# Altium schematic sheet FMB_MOS.SchDoc
size A3
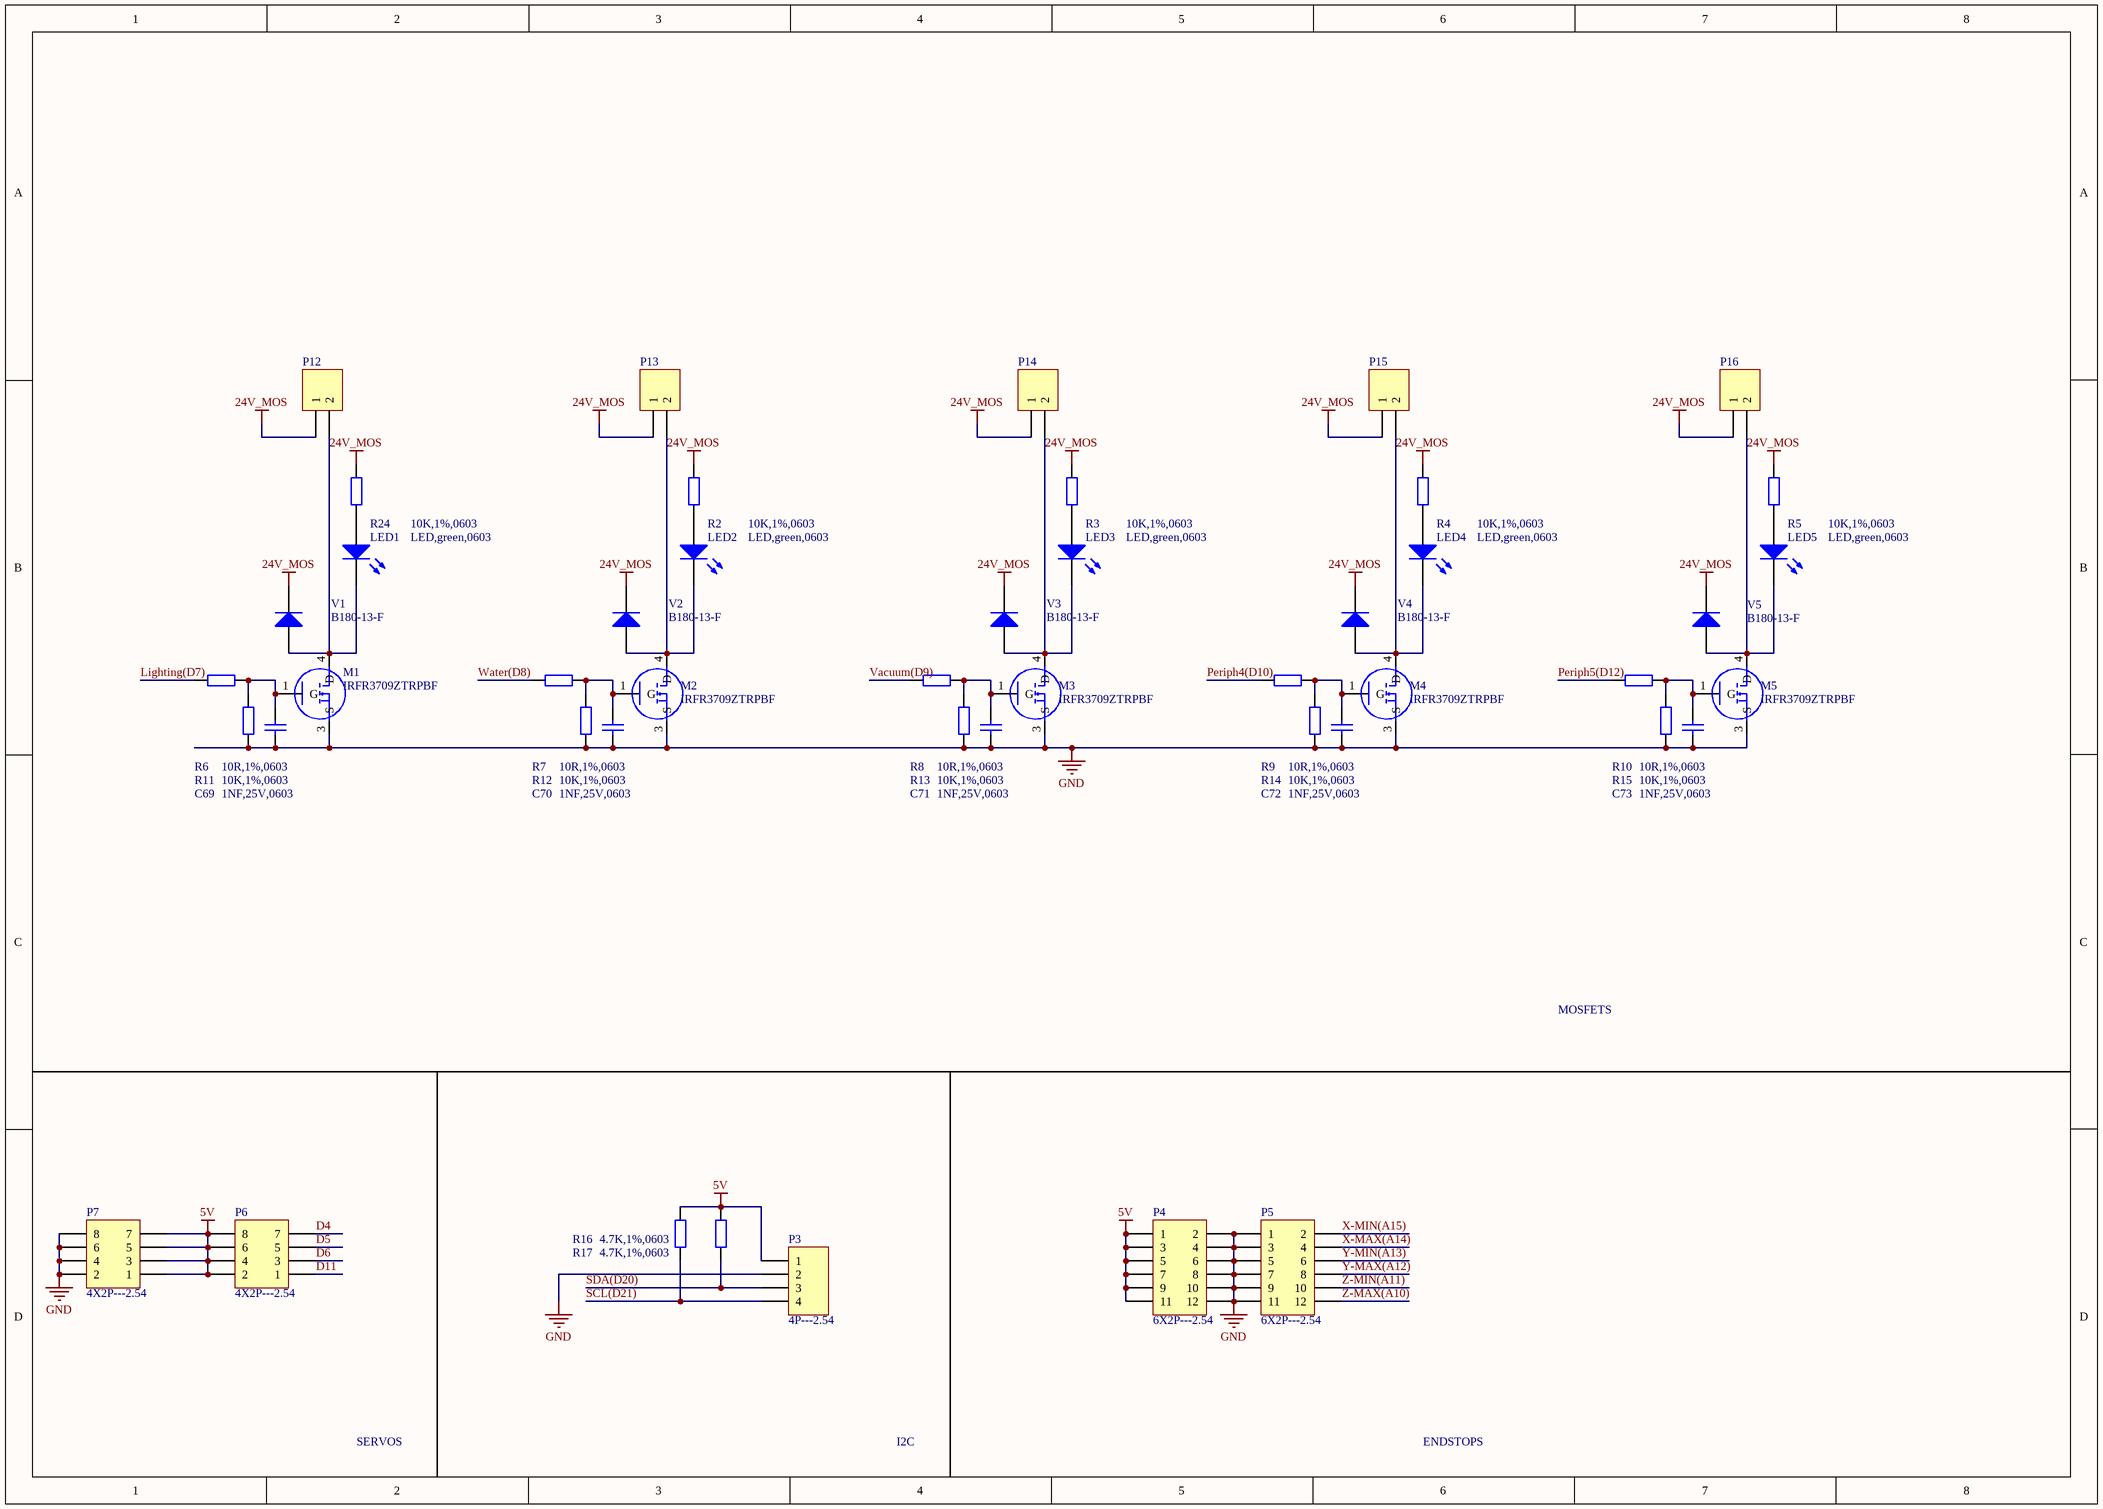
[diagram p0: FMB_MOS.SchDoc]

## Parts
C69  1NF,25V,0603  [RC0603]
C70  1NF,25V,0603  [RC0603]
C71  1NF,25V,0603  [RC0603]
C72  1NF,25V,0603  [RC0603]
C73  1NF,25V,0603  [RC0603]
LED1  LED,green,0603  [LED-0603]
LED2  LED,green,0603  [LED-0603]
LED3  LED,green,0603  [LED-0603]
LED4  LED,green,0603  [LED-0603]
LED5  LED,green,0603  [LED-0603]
M1  IRFR3709ZTRPBF  [DPAK]
M2  IRFR3709ZTRPBF  [DPAK]
M3  IRFR3709ZTRPBF  [DPAK]
M4  IRFR3709ZTRPBF  [DPAK]
M5  IRFR3709ZTRPBF  [DPAK]
P3  4P---2.54  [HDR1X4]
P4  6X2P---2.54  [HDR2X6]
P5  6X2P---2.54  [HDR2X6]
P6  4X2P---2.54  [HDR2X4]
P7  4X2P---2.54  [HDR2X4]
P12  Molex 151048-1206  [151048]  (value not drawn)
P13  Molex 151048-1206  [151048]  (value not drawn)
P14  Molex 151048-1206  [151048]  (value not drawn)
P15  Molex 151048-1206  [151048]  (value not drawn)
P16  Molex 151048-1206  [151048]  (value not drawn)
R2  10K,1%,0603  [RC0603]
R3  10K,1%,0603  [RC0603]
R4  10K,1%,0603  [RC0603]
R5  10K,1%,0603  [RC0603]
R6  10R,1%,0603  [RC0603]
R7  10R,1%,0603  [RC0603]
R8  10R,1%,0603  [RC0603]
R9  10R,1%,0603  [RC0603]
R10  10R,1%,0603  [RC0603]
R11  10K,1%,0603  [RC0603]
R12  10K,1%,0603  [RC0603]
R13  10K,1%,0603  [RC0603]
R14  10K,1%,0603  [RC0603]
R15  10K,1%,0603  [RC0603]
R16  4.7K,1%,0603  [RC0603]
R17  4.7K,1%,0603  [RC0603]
R24  10K,1%,0603  [RC0603]
V1  B180-13-F  [SMA]
V2  B180-13-F  [SMA]
V3  B180-13-F  [SMA]
V4  B180-13-F  [SMA]
V5  B180-13-F  [SMA]

## Nets
5V: P3.1 P4.1 P4.3 P4.5 P4.7 P4.9 P4.11 P6.2 P6.4 P6.6 P6.8 P7.1 P7.3 P7.5 P7.7 R16.2 R17.2
24V_MOS: P12.1 P13.1 P14.1 P15.1 P16.1 R2.1 R3.1 R4.1 R5.1 R24.1 V1.2(K) V2.2(K) V3.2(K) V4.2(K) V5.2(K)
GND: C69.1 C70.1 C71.1 C72.1 C73.1 M1.3(S) M2.3(S) M3.3(S) M4.3(S) M5.3(S) P3.2 P4.2 P4.4 P4.6 P4.8 P4.10 P4.12 P5.1 P5.3 P5.5 P5.7 P5.9 P5.11 P7.2 P7.4 P7.6 P7.8 R11.1 R12.1 R13.2 R14.1 R15.1
D4: P6.7
D5: P6.5
D6: P6.3
D11: P6.1
Lighting(D7): R6.1
Periph4(D10): R9.1
Periph5(D12): R10.1
SCL(D21): P3.4 R16.1
SDA(D20): P3.3 R17.1
Vacuum(D9): R8.1
Water(D8): R7.1
X-MAX(A14): P5.4
X-MIN(A15): P5.2
Y-MAX(A12): P5.8
Y-MIN(A13): P5.6
Z-MAX(A10): P5.12
Z-MIN(A11): P5.10
NetC69_2: C69.2 M1.1(G) R6.2 R11.2
NetC70_2: C70.2 M2.1(G) R7.2 R12.2
NetC71_2: C71.2 M3.1(G) R8.2 R13.1
NetC72_2: C72.2 M4.1(G) R9.2 R14.2
NetC73_2: C73.2 M5.1(G) R10.2 R15.2
NetLED1_1: LED1.1(A) R24.2
NetLED1_2: LED1.2(K) M1.4(D) P12.2 V1.1(A)
NetLED2_1: LED2.1(A) R2.2
NetLED2_2: LED2.2(K) M2.4(D) P13.2 V2.1(A)
NetLED3_1: LED3.1(A) R3.2
NetLED3_2: LED3.2(K) M3.4(D) P14.2 V3.1(A)
NetLED4_1: LED4.1(A) R4.2
NetLED4_2: LED4.2(K) M4.4(D) P15.2 V4.1(A)
NetLED5_1: LED5.1(A) R5.2
NetLED5_2: LED5.2(K) M5.4(D) P16.2 V5.1(A)

## Notes on the sheet
- MOSFETS
- SERVOS
- I2C
- ENDSTOPS

## Library data of the parts
C69-C73 = Cap: Capacitor; Value: 100pF; Published: 8-Jun-2000; LatestRevisionDate: 17-Jul-2002; LatestRevisionNote: Re-released for DXP Platform.; PackageReference: RAD-0.3; Publisher: Altium Limited; PackageDescription: Radial Cap, Thru-Hole; 2 Leads; 0.3 in Pin Spacing
LED1-LED5 = LED0: Typical INFRARED GaAs LED; Published: 8-Jun-2000; LatestRevisionDate: 08-Jul-2005; LatestRevisionNote: Mech Layer 1 removed.; PackageReference: LED-0; Publisher: Altium Limited; PackageDescription: LED; 2 Leads
M1-M5 = AP94T07
P3 = Header 4: Header, 4-Pin; LatestRevisionDate: 17-Jul-2002; LatestRevisionNote: Re-released for DXP Platform.; Publisher: Altium Limited
P4 P5 = Header 6X2: Header, 6-Pin, Dual row; LatestRevisionDate: 17-Jul-2002; LatestRevisionNote: Re-released for DXP Platform.; Publisher: Altium Limited
P6 P7 = Header 4X2: Header, 4-Pin, Dual row; LatestRevisionDate: 17-Jul-2002; LatestRevisionNote: Re-released for DXP Platform.; Publisher: Altium Limited
P12-P16 = Header 2: Header, 2-Pin; LatestRevisionDate: 17-Jul-2002; LatestRevisionNote: Re-released for DXP Platform.; Publisher: Altium Limited
R2-R17 R24 = Res2: Resistor; Value: 1K; Published: 8-Jun-2000; LatestRevisionDate: 17-Jul-2002; LatestRevisionNote: Re-released for DXP Platform.; PackageReference: AXIAL-0.4; Publisher: Altium Limited; PackageDescription: Axial Device, Thru-Hole; 2 Leads; 0.4 in Pin Spacing
V1-V5 = Diode: Default Diode; Published: 8-Jun-2000; LatestRevisionDate: 17-Jul-2002; LatestRevisionNote: Re-released for DXP Platform.; PackageVersion: Sep-1996; PackageReference: SMC; Publisher: Altium Limited; PackageDescription: DO-214-AB/SMC; 2 C-Bend Leads; Body 7.9 x 5.9 mm, inc. leads (LxW); Code_JEDEC: DO-214-AB